# Altium schematic sheet Relay_Board_wiring_v1.0.SchDoc
size A4
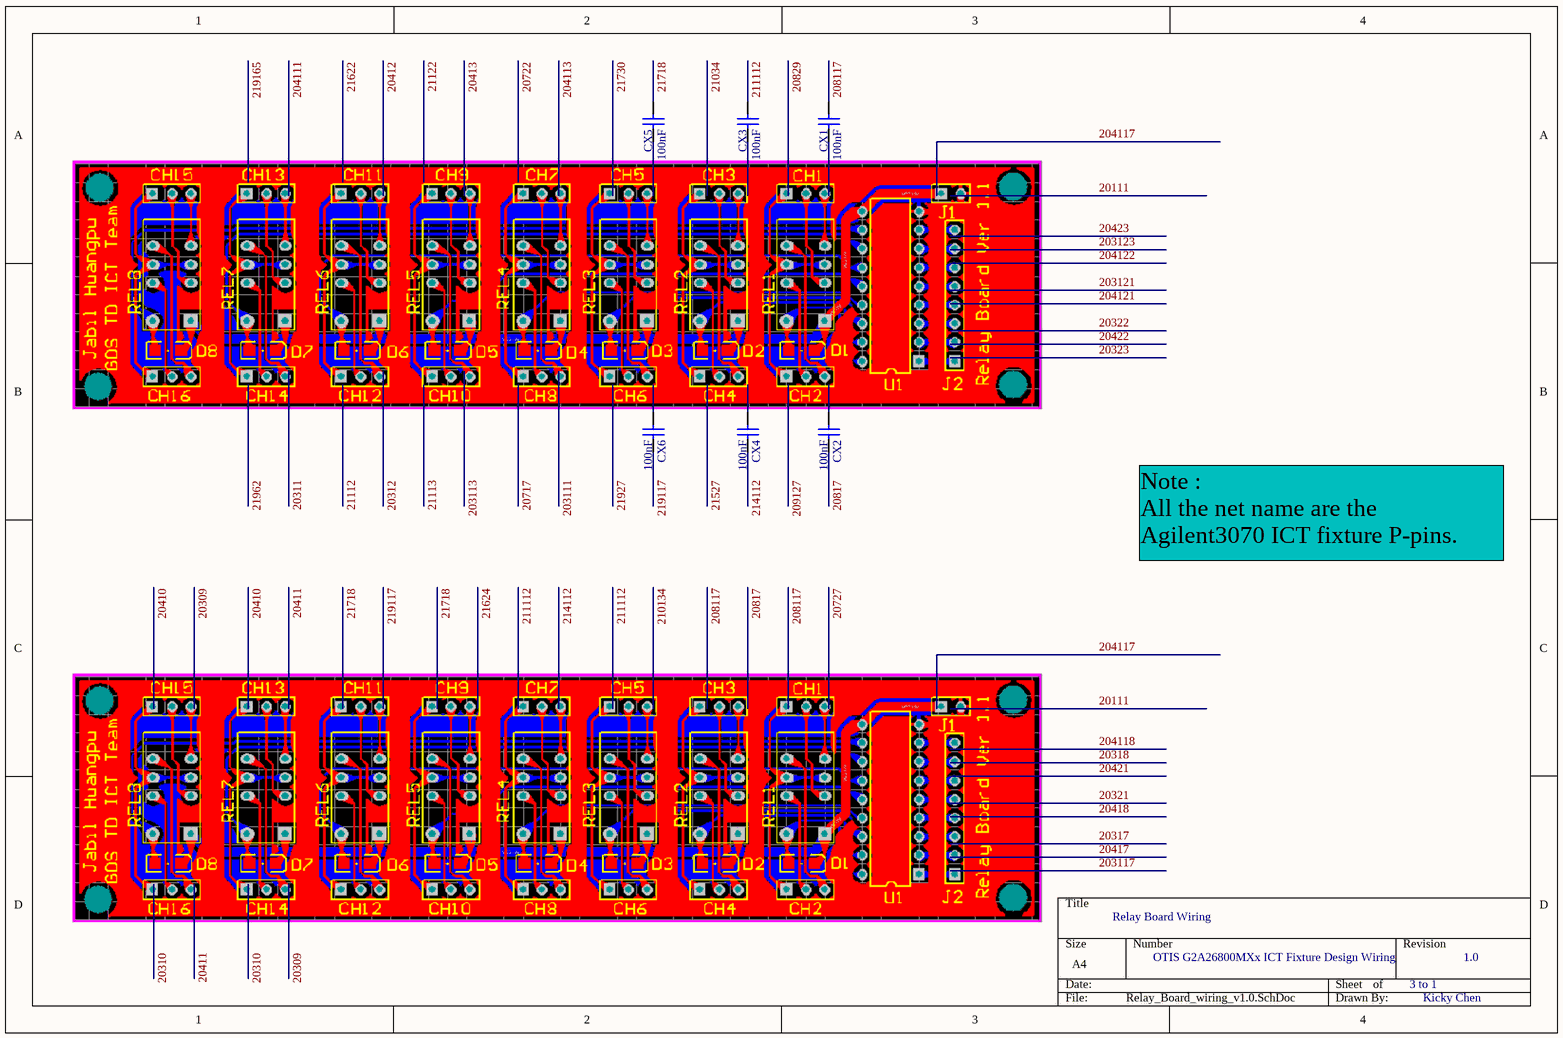
[diagram p0: Relay_Board_wiring_v1.0.SchDoc]

## Parts
CX1  value 100nF  [1608[0603]]  (hidden comment: Cap Semi)
CX2  value 100nF  [1608[0603]]  (hidden comment: Cap Semi)
CX3  value 100nF  [1608[0603]]  (hidden comment: Cap Semi)
CX4  value 100nF  [1608[0603]]  (hidden comment: Cap Semi)
CX5  value 100nF  [1608[0603]]  (hidden comment: Cap Semi)
CX6  value 100nF  [1608[0603]]  (hidden comment: Cap Semi)

## Nets
20817: CX2.1
21718: CX5.2
208117: CX1.2
211112: CX3.2
214112: CX4.1
219117: CX6.1

Not connected (* = marked no-connect by the designer): CX1 1; CX2 2; CX3 1; CX4 2; CX5 1; CX6 2

## Notes on the sheet
- Note :
  All the net name are the Agilent3070 ICT fixture P-pins.
- Relay Board Wiring
- OTIS G2A26800MXx ICT Fixture Design Wiring
- 3 to 1
- 1.0
- Kicky Chen

## Library data of the parts
CX1-CX6 = Cap Semi: Capacitor (Semiconductor SIM Model); Published: 8-Jun-2000; LatestRevisionDate: 17-Jul-2002; LatestRevisionNote: Re-released for DXP Platform.; PackageReference: C1206; Publisher: Altium Limited